# EAGLE schematic DHT Board-v.1.1 (EAGLE 8.4.1)
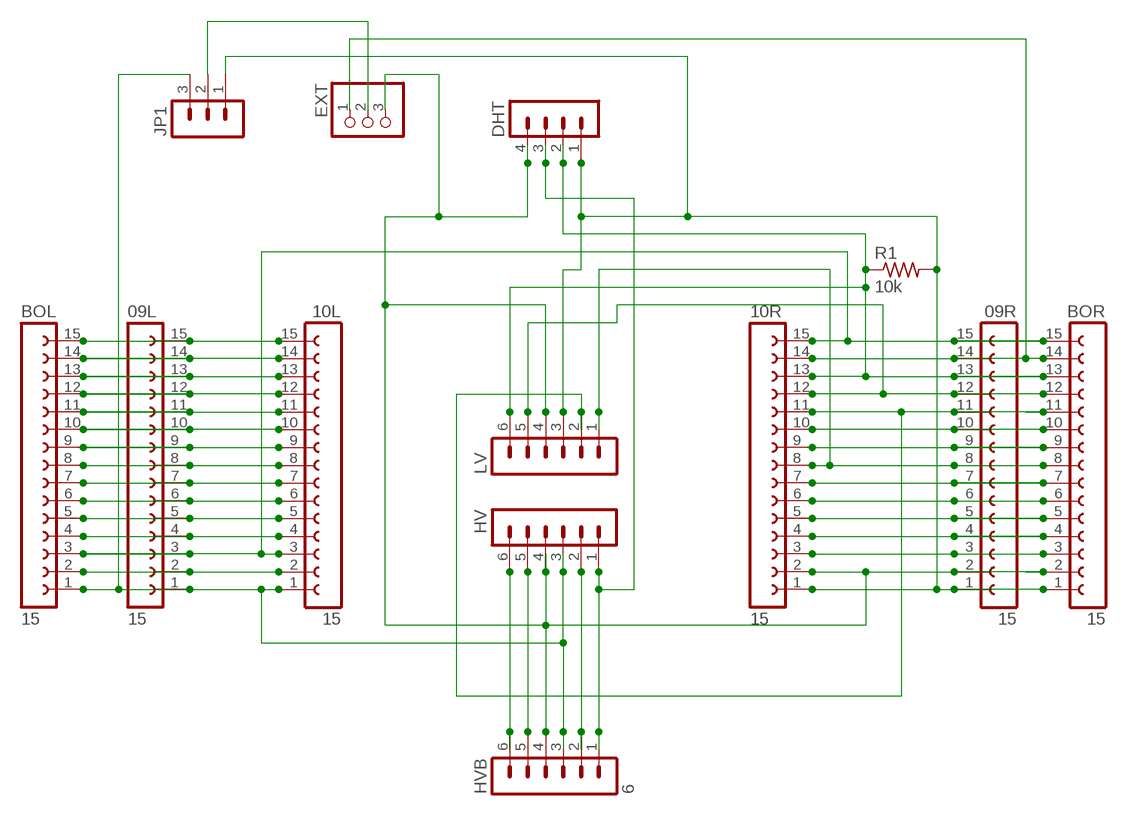
[diagram p0: schematic, sheet 1]

## Parts
09L  15  FE15-1  [FE15]
09R  15  FE15-1  [FE15]
10L  15  FE15-1  [FE15]
10R  15  FE15-1  [FE15]
BOL  15  FE15-1  [FE15]
BOR  15  FE15-1  [FE15]
DHT  MA04-1  [MA04-1]
EXT  PINHD-1X3  [1X03]
HV  MA06-1  [MA06-1]
HVB  6  MA06-1  [MA06-1]
JP1  MA03-1  [MA03-1]
LV  MA06-1  [MA06-1]
R1  10k  R-US_0207/10  [0207/10]

## Nets
3.3V: 09R.1 09R.10 10R.1 10R.10 BOR.1 BOR.10 DHT.1 JP1.1 LV.3 R1.2
3.3V2: 09L.5 10L.5 BOL.5
5V: 09L.1 10L.1 BOL.1 HV.3 HVB.3 JP1.3
A0: 09L.15 10L.15 BOL.15
CLK: 09L.7 10L.7 BOL.7
CMD: 09L.9 10L.9 BOL.9
D0: 09L.3 09R.15 10L.3 10R.15 BOL.3 BOR.15
D1: 09R.14 10R.14 BOR.14 EXT.1
D2: 09R.13 10R.13 BOR.13 DHT.2 LV.6 R1.1
D3: 09R.12 10R.12 BOR.12 LV.5
D4: 09R.11 10R.11 BOR.11 LV.2
D5: 09R.8 10R.8 BOR.8 LV.1
D6: 09R.7 10R.7 BOR.7
D7: 09R.6 10R.6 BOR.6
D8: 09R.5 10R.5 BOR.5
D9: 09R.4 10R.4 BOR.4
D10: 09R.3 10R.3 BOR.3
EN: 09L.4 10L.4 BOL.4
GND: 09R.2 09R.9 10R.2 10R.9 BOR.2 BOR.9 DHT.4 EXT.3 HV.4 HVB.4 LV.4
GND1: 09L.2 10L.2 BOL.2
GND2: 09L.6 10L.6 BOL.6
N$10: 09L.14 10L.14 BOL.14
N$11: 09L.13 10L.13 BOL.13
N$32: DHT.3 HV.1 HVB.1
N$33: HV.2 HVB.2
N$34: HV.5 HVB.5
N$35: HV.6 HVB.6
SD0: 09L.8 10L.8 BOL.8
SD1: 09L.10 10L.10 BOL.10
SD2: 09L.11 10L.11 BOL.11
SD3: 09L.12 10L.12 BOL.12
VCC: EXT.2 JP1.2

## Library data of the parts
09L 09R 10L 10R BOL BOR = con-lsta:FE15-1: FEMALE HEADER; OC_FARNELL: unknown; OC_NEWARK: unknown
DHT = con-lstb:MA04-1: PIN HEADER; OC_FARNELL: unknown; OC_NEWARK: unknown
EXT = pinhead:PINHD-1X3: PIN HEADER
HV HVB LV = con-lstb:MA06-1: PIN HEADER; OC_FARNELL: unknown; OC_NEWARK: unknown
JP1 = con-lstb:MA03-1: PIN HEADER; OC_FARNELL: unknown; OC_NEWARK: unknown
R1 = resistor:R-US_: RESISTOR, American symbol